# Altium schematic sheet RF MODULE.SchDoc
size A3
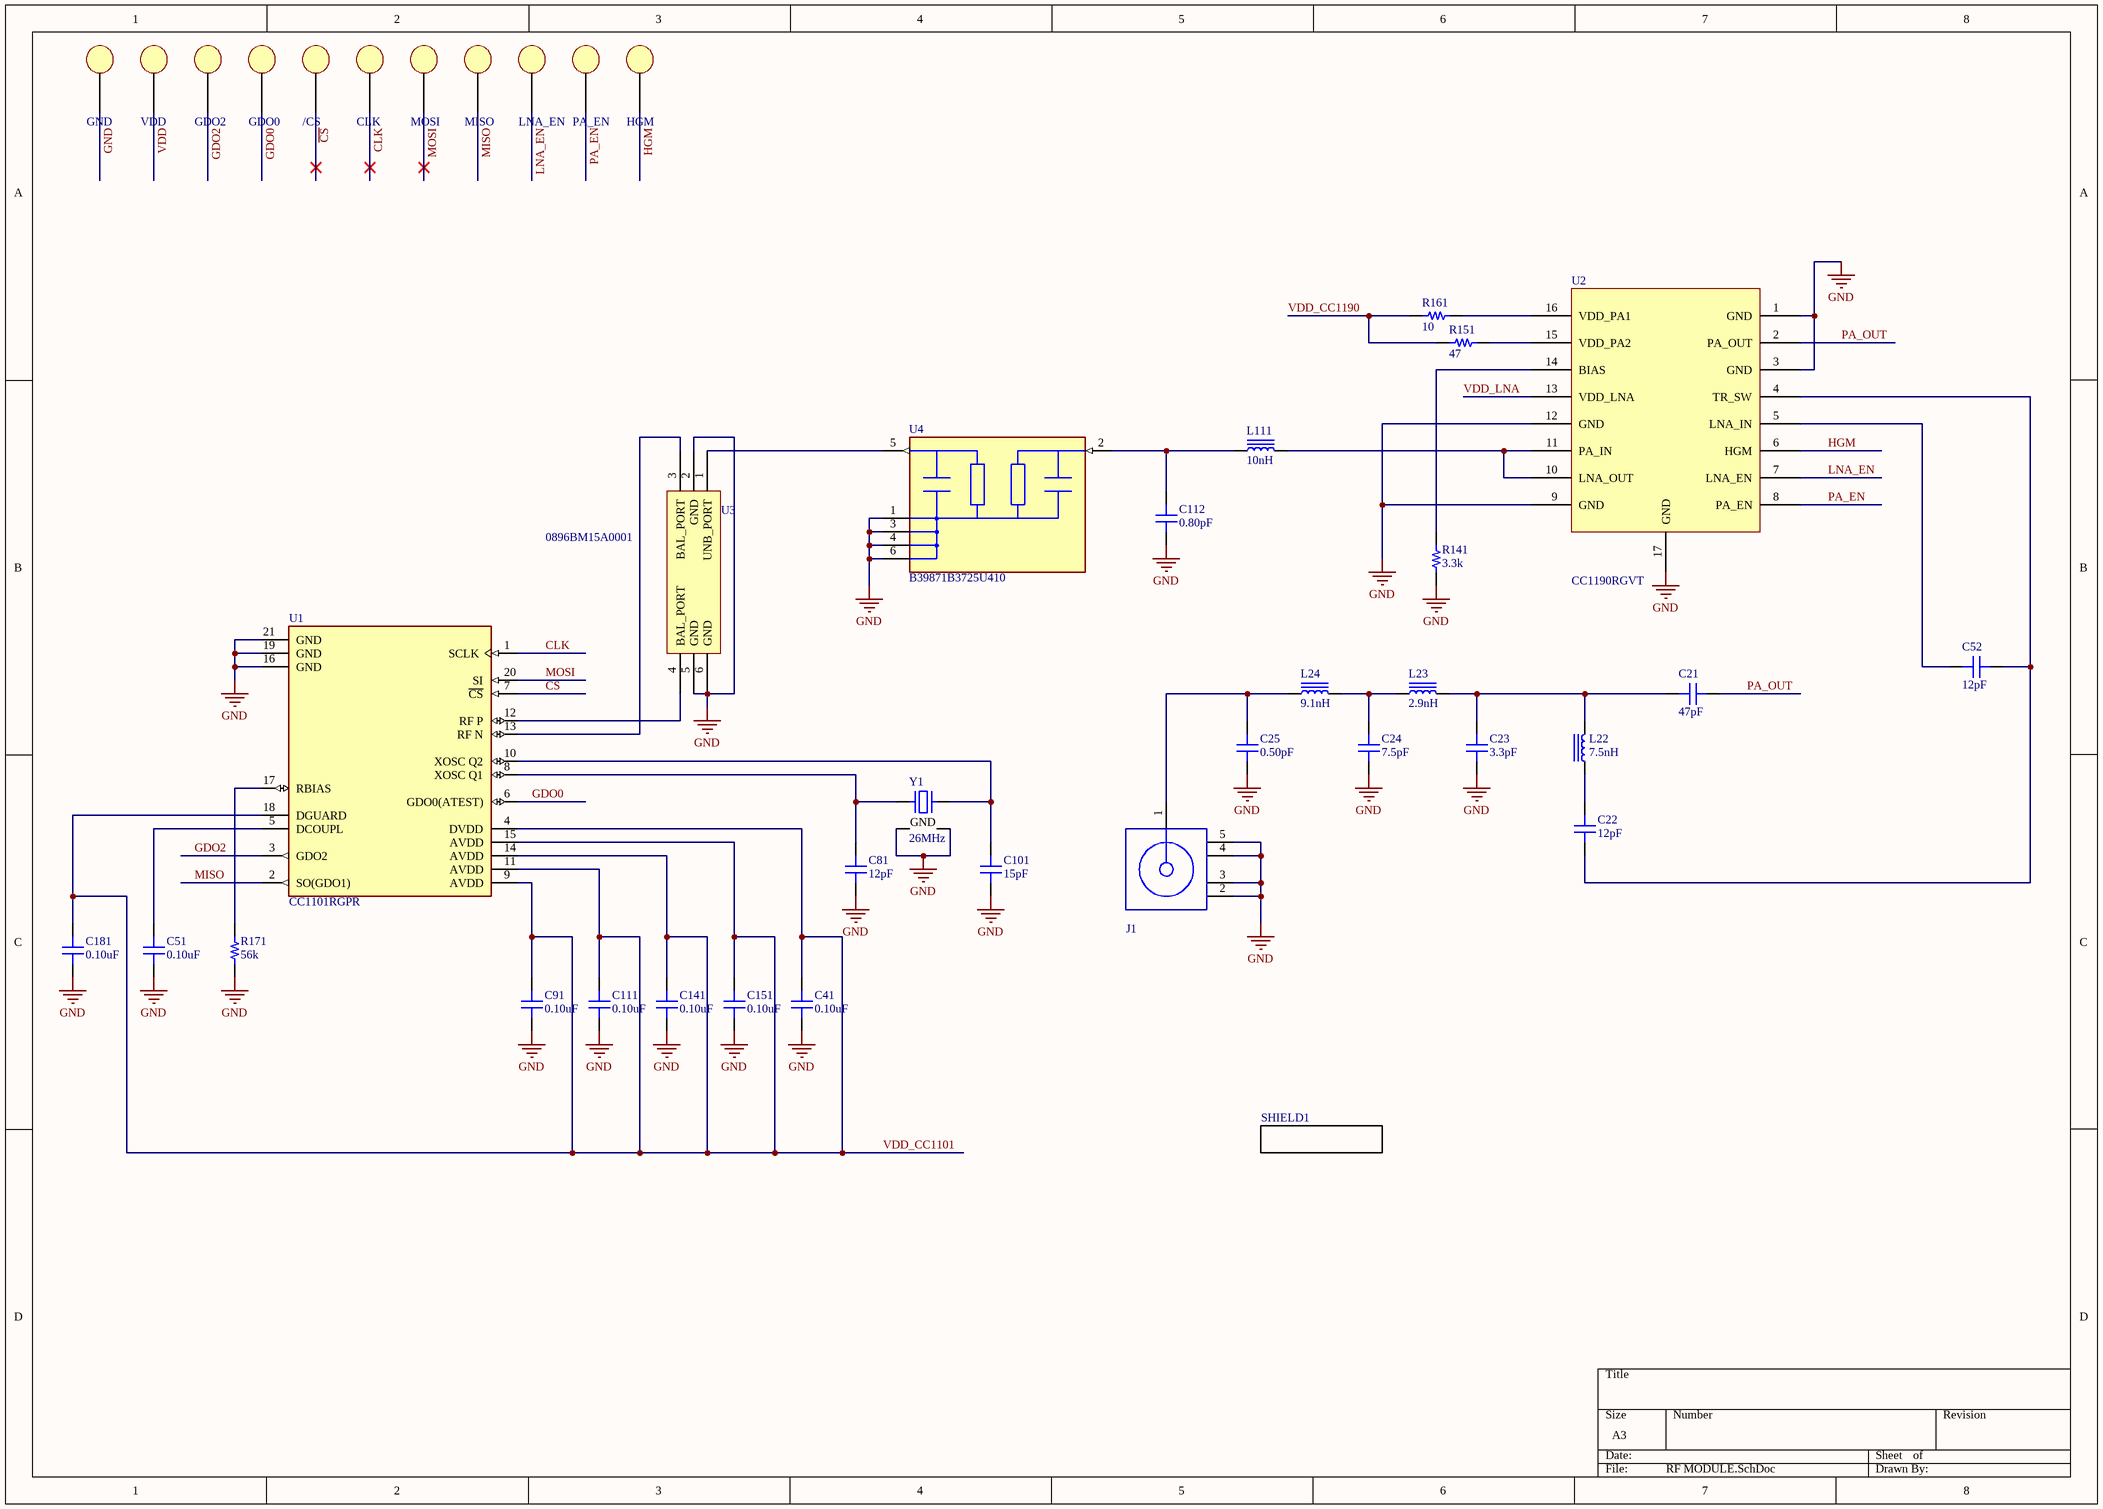
[diagram p0: RF MODULE.SchDoc]

## Parts
/CS  Castellation  [Castellation]  (value not drawn)
C21  47pF  [CAP 0402/1005]
C22  12pF  [CAP 0402/1005]
C23  3.3pF  [CAP 0402/1005]
C24  7.5pF  [CAP 0402/1005]
C25  0.50pF  [CAP 0402/1005]
C41  0.10uF  [CAP 0402/1005]
C51  0.10uF  [CAP 0402/1005]
C52  12pF  [CAP 0402/1005]
C81  12pF  [CAP 0402/1005]
C91  0.10uF  [CAP 0402/1005]
C101  15pF  [CAP 0402/1005]
C111  0.10uF  [CAP 0402/1005]
C112  0.80pF  [CAP 0402/1005]
C141  0.10uF  [CAP 0402/1005]
C151  0.10uF  [CAP 0402/1005]
C181  0.10uF  [CAP 0402/1005]
CLK  Castellation  [Castellation]  (value not drawn)
GDO0  Castellation  [Castellation]  (value not drawn)
GDO2  Castellation  [Castellation]  (value not drawn)
GND  Castellation  [Castellation]  (value not drawn)
HGM  Castellation  [Castellation]  (value not drawn)
J1  73251-1150  [Molex_73251-1150_0]  (value not drawn)
L22  7.5nH  [IND 0402/1005 RF WW]
L23  2.9nH  [IND 0402/1005 RF WW]
L24  9.1nH  [IND 0402/1005 RF WW]
L111  10nH  [IND 0402/1005 RF WW]
LNA_EN  Castellation  [Castellation]  (value not drawn)
MISO  Castellation  [Castellation]  (value not drawn)
MOSI  Castellation  [Castellation]  (value not drawn)
PA_EN  Castellation  [Castellation]  (value not drawn)
R141  3.3k  [RES 0402/1005]
R151  47  [RES 0402/1005]
R161  10  [RES 0402/1005]
R171  56k  [RES 0402/1005]
SHIELD1  SMS-202F  [SMS-202F]  (value not drawn)
U1  CC1101RGPR  [Texas_Instruments_RGP0020C_0]
U2  CC1190RGVT  [QFN65P400X400X100_HS-17N]
U3  0896BM15A0001  [0896BM15A0001]
U4  Part Number: B39871B3725U410  [TDK_B39871B3725U410_0]  (hidden comment: Filter_TDK_B39871B3725U410_eec)
VDD  Castellation  [Castellation]  (value not drawn)
Y1  26MHz  [NDK NX2520SA]

## Nets
GND: C23.1 C24.1 C25.1 C41.1 C51.1 C81.1 C91.1 C101.1 C111.1 C112.1 C141.1 C151.1 C181.1 GND.PIN J1.2(MNT_1) J1.3(MNT_2) J1.4(MNT_3) J1.5(MNT_4) R141.1 R171.1 U1.16(GND) U1.19(GND) U1.21(GND) U2.1(GND) U2.3(GND) U2.9(GND) U2.12(GND) U2.17(GND) U3.2(GND) U3.5(GND) U3.6(GND) U4.1(Ground) U4.3(Ground) U4.4(Ground) U4.6(Ground) Y1.2(GND) Y1.4(GND)
~{CS}: /CS.PIN U1.7(~{CS})
CLK: CLK.PIN U1.1(SCLK)
GDO0: GDO0.PIN U1.6(GDO0(ATEST))
GDO2: GDO2.PIN U1.3(GDO2)
HGM: HGM.PIN U2.6(HGM)
LNA_EN: LNA_EN.PIN U2.7(LNA_EN)
MISO: MISO.PIN U1.2(SO(GDO1))
MOSI: MOSI.PIN U1.20(SI)
PA_EN: PA_EN.PIN U2.8(PA_EN)
PA_OUT: C21.2 U2.2(PA_OUT)
VDD: VDD.PIN
VDD_CC1101: C41.2 C91.2 C111.2 C141.2 C151.2 C181.2 U1.4(DVDD) U1.9(AVDD) U1.11(AVDD) U1.14(AVDD) U1.15(AVDD) U1.18(DGUARD)
VDD_CC1190: R151.1 R161.1
VDD_LNA: U2.13(VDD_LNA)
NetC21_1: C21.1 C23.2 L22.2 L23.2
NetC22_1: C22.1 C52.2 U2.4(TR_SW)
NetC22_2: C22.2 L22.1
NetC24_2: C24.2 L23.1 L24.2
NetC25_2: C25.2 J1.1 L24.1
NetC51_2: C51.2 U1.5(DCOUPL)
NetC52_1: C52.1 U2.5(LNA_IN)
NetC81_2: C81.2 U1.8(XOSC_Q1) Y1.1
NetC101_2: C101.2 U1.10(XOSC_Q2) Y1.3
NetC112_2: C112.2 L111.1 U4.2(Input)
NetL111_2: L111.2 U2.10(LNA_OUT) U2.11(PA_IN)
NetR141_2: R141.2 U2.14(BIAS)
NetR151_2: R151.2 U2.15(VDD_PA2)
NetR161_2: R161.2 U2.16(VDD_PA1)
NetR171_2: R171.2 U1.17(RBIAS)
NetU1_12: U1.12(RF_P) U3.4(BAL_PORT)
NetU1_13: U1.13(RF_N) U3.3(BAL_PORT)
NetU3_1: U3.1(UNB_PORT) U4.5(Output)

## Library data of the parts
/CS CLK GDO0 GDO2 GND HGM LNA_EN MISO MOSI PA_EN VDD = Castellation: CustomComponentID: 5jvg54js08ca3bt85oae
C21 = GRM1555C1H470JA01D: CAP CER 47PF 50V NP0 0402; Manufacturer: Murata Electronics North America; TemperatureRange: -55C ~ 125C; TemperatureCoefficient: C0G, NP0; Tolerance: 5%; Value: 47pF; Part Number: GRM1555C1H470JA01D; PartId: 4827; Supplier 1: Digi-Key; Supplier Part Number 1: 490-5942-2-ND; ComponentLink1Description: Datasheet; ComponentLink1URL: http://www.murata.com/~/media/webrenewal/support/library/catalog/products/capacitor/mlcc/c02e.ashx; ComponentLink2Description: Digi-Key listing; ComponentLink2URL: http://digikey.com/product-detail/en/GRM1555C1H470JA01D/490-5942-2-ND/3693853; Voltage: 50V; Price: 0,0033; Type: -; Device Package: 0402 (1005 Metric)
C22 C81 = GRM1555C1H120JA01D: CAP CER 12PF 50V NP0 0402; Manufacturer: Murata Electronics North America; TemperatureRange: -55C ~ 125C; TemperatureCoefficient: C0G, NP0; Tolerance: 5%; Value: 12pF; Part Number: GRM1555C1H120JA01D; PartId: 4835; Supplier 1: Digi-Key; Supplier Part Number 1: 490-5924-2-ND; ComponentLink1Description: Datasheet; ComponentLink1URL: http://www.murata.com/~/media/webrenewal/support/library/catalog/products/capacitor/mlcc/c02e.ashx; ComponentLink2Description: Digi-Key listing; ComponentLink2URL: http://digikey.com/product-detail/en/GRM1555C1H120JA01D/490-5924-2-ND/3693831; Voltage: 50V; Price: 0,0042; Type: -; Device Package: 0402 (1005 Metric)
C23 = GRM1555C1H3R3CA01D: CAP CER 3.3PF 50V NP0 0402; Manufacturer: Murata Electronics North America; TemperatureRange: -55C ~ 125C; TemperatureCoefficient: C0G, NP0; Tolerance: 0.25pF; Value: 3.3pF; Part Number: GRM1555C1H3R3CA01D; PartId: 4911; Supplier 1: Digi-Key; Supplier Part Number 1: 490-5938-2-ND; ComponentLink1Description: Datasheet; ComponentLink1URL: http://www.murata.com/~/media/webrenewal/support/library/catalog/products/capacitor/mlcc/c02e.ashx; ComponentLink2Description: Digi-Key listing; ComponentLink2URL: http://digikey.com/product-detail/en/GRM1555C1H3R3CA01D/490-5938-2-ND/3693848; Voltage: 50V; Price: 0,0069; Type: -; Device Package: 0402 (1005 Metric)
C24 = GRM1555C1H7R5CA01D: CAP CER 7.5PF 50V NP0 0402; Manufacturer: Murata Electronics North America; TemperatureRange: -55C ~ 125C; TemperatureCoefficient: C0G, NP0; Tolerance: 0.25pF; Value: 7.5pF; Part Number: GRM1555C1H7R5CA01D; PartId: 4924; Supplier 1: Digi-Key; Supplier Part Number 1: 490-7219-2-ND; ComponentLink1Description: Datasheet; ComponentLink1URL: http://www.murata.com/~/media/webrenewal/support/library/catalog/products/capacitor/mlcc/c02e.ashx; ComponentLink2Description: Digi-Key listing; ComponentLink2URL: http://digikey.com/product-detail/en/GRM1555C1H7R5CA01D/490-7219-2-ND/3693883; Voltage: 50V; Price: 0,0069; Type: -; Device Package: 0402 (1005 Metric)
C25 = GRM1555C1HR50BA01D: CAP CER 0.50PF 50V NP0 0402; Manufacturer: Murata Electronics North America; TemperatureRange: -55C ~ 125C; TemperatureCoefficient: C0G, NP0; Tolerance: 0.1pF; Value: 0.50pF; Part Number: GRM1555C1HR50BA01D; PartId: 5016; Supplier 1: Digi-Key; Supplier Part Number 1: 490-6263-2-ND; ComponentLink1Description: Datasheet; ComponentLink1URL: http://www.murata.com/~/media/webrenewal/support/library/catalog/products/capacitor/mlcc/c02e.ashx; ComponentLink2Description: Digi-Key listing; ComponentLink2URL: http://digikey.com/product-detail/en/GRM1555C1HR50BA01D/490-6263-2-ND/3694055; Voltage: 50V; Price: 0,0108; Type: -; Device Package: 0402 (1005 Metric)
C41 C51 C91 C111 C141 C151 C181 = GRM152R61A104KE19D: CAP CER 0.1UF 10V X5R 0402; Manufacturer: Murata Electronics North America; TemperatureRange: -55C ~ 85C; Tolerance: 10%; Value: 0.10uF; Part Number: GRM152R61A104KE19D; PartId: 12630; Supplier 1: Digi-Key; Supplier Part Number 1: 490-10008-2-ND; ComponentLink1Description: Datasheet; ComponentLink1URL: http://www.murata.com/~/media/webrenewal/support/library/catalog/products/capacitor/mlcc/c02e.pdf; ComponentLink2Description: Digi-Key Listing; ComponentLink2URL: https://www.digikey.com/product-detail/en/murata-electronics-north-america/GRM152R61A104KE19D/490-10008-2-ND/4904813; TemperatureCoefficient: X5R; Voltage: 10V; Price: 0,0207; Device Package: 0402 (1005 Metric)
C52 = GRM1555C1H120FA01D: CAP CER 12PF 50V NP0 0402; Manufacturer: Murata Electronics North America; TemperatureRange: -55C ~ 125C; TemperatureCoefficient: C0G, NP0; Tolerance: 1%; Value: 12pF; Part Number: GRM1555C1H120FA01D; PartId: 5082; Supplier 1: Digi-Key; Supplier Part Number 1: 490-6196-2-ND; ComponentLink1Description: Datasheet; ComponentLink1URL: http://www.murata.com/~/media/webrenewal/support/library/catalog/products/capacitor/mlcc/c02e.ashx; ComponentLink2Description: Digi-Key listing; ComponentLink2URL: http://digikey.com/product-detail/en/GRM1555C1H120FA01D/490-6196-2-ND/3693922; Voltage: 50V; Price: 0,0133; Type: -; Device Package: 0402 (1005 Metric)
C101 = GRM1555C1H150JA01D: CAP CER 15PF 50V NP0 0402; Manufacturer: Murata Electronics North America; TemperatureRange: -55C ~ 125C; TemperatureCoefficient: C0G, NP0; Tolerance: 5%; Value: 15pF; Part Number: GRM1555C1H150JA01D; PartId: 4811; Supplier 1: Digi-Key; Supplier Part Number 1: 490-5888-2-ND; ComponentLink1Description: Datasheet; ComponentLink1URL: http://www.murata.com/~/media/webrenewal/support/library/catalog/products/capacitor/mlcc/c02e.ashx; ComponentLink2Description: Digi-Key listing; ComponentLink2URL: http://digikey.com/product-detail/en/GRM1555C1H150JA01D/490-5888-2-ND/2791374; Voltage: 50V; Price: 0,0032; Type: -; Device Package: 0402 (1005 Metric)
C112 = GRM1555C1HR80BA01D: CAP CER 0.80PF 50V NP0 0402; Manufacturer: Murata Electronics North America; TemperatureRange: -55C ~ 125C; TemperatureCoefficient: C0G, NP0; Tolerance: 0.1pF; Value: 0.80pF; Part Number: GRM1555C1HR80BA01D; PartId: 5139; Supplier 1: Digi-Key; Supplier Part Number 1: 490-6269-2-ND; ComponentLink1Description: Datasheet; ComponentLink1URL: http://www.murata.com/~/media/webrenewal/support/library/catalog/products/capacitor/mlcc/c02e.ashx; ComponentLink2Description: Digi-Key listing; ComponentLink2URL: http://digikey.com/product-detail/en/GRM1555C1HR80BA01D/490-6269-2-ND/3694062; Voltage: 50V; Price: 0,0178; Type: -; Device Package: 0402 (1005 Metric)
J1 = 73251-1150: SMA socket
L22 = LQW15AN7N5G00D: FIXED IND 7.5NH 570MA 130 MOHM; Manufacturer: Murata Electronics North America; TemperatureRange: -55C ~ 125C; Tolerance: 2%; Type: Wirewound; Q at Frequency: 25 @ 250MHz; DC Resistance: 130 mOhm Max; Shielding: Unshielded; Value: 7.5nH; Part Number: LQW15AN7N5G00D; PartId: 6416; Supplier 1: Digi-Key; Supplier Part Number 1: 490-6846-2-ND; ComponentLink1Description: Datasheet; ComponentLink1URL: http://search.murata.co.jp/Ceramy/image/img/PDF/ENG/L0075S0080LQW15A_00.pdf; ComponentLink2Description: Digi-Key listing; ComponentLink2URL: http://digikey.com/product-detail/en/LQW15AN7N5G00D/490-6846-2-ND/2594958; Price: 0,0807; Device Package: 0402 (1005 Metric)
L23 = LQW15AN2N9B00D: FIXED IND 2.9NH 750MA 70 MOHM; Manufacturer: Murata Electronics North America; TemperatureRange: -55C ~ 125C; Tolerance: 0.1nH; Type: Wirewound; Q at Frequency: 20 @ 250MHz; DC Resistance: 70 mOhm Max; Shielding: Unshielded; Value: 2.9nH; Part Number: LQW15AN2N9B00D; PartId: 6410; Supplier 1: Digi-Key; Supplier Part Number 1: 490-6801-2-ND; ComponentLink1Description: Datasheet; ComponentLink1URL: http://search.murata.co.jp/Ceramy/image/img/PDF/ENG/L0075S0080LQW15A_00.pdf; ComponentLink2Description: Digi-Key listing; ComponentLink2URL: http://digikey.com/product-detail/en/LQW15AN2N9B00D/490-6801-2-ND/2594891; Price: 0,0807; Device Package: 0402 (1005 Metric)
L24 = LQW15AN9N1G00D: FIXED IND 9.1NH 540MA 140 MOHM; Manufacturer: Murata Electronics North America; TemperatureRange: -55C ~ 125C; Tolerance: 2%; Type: Wirewound; Q at Frequency: 25 @ 250MHz; DC Resistance: 140 mOhm Max; Shielding: Unshielded; Value: 9.1nH; Part Number: LQW15AN9N1G00D; PartId: 6429; Supplier 1: Digi-Key; Supplier Part Number 1: 490-6854-2-ND; ComponentLink1Description: Datasheet; ComponentLink1URL: http://search.murata.co.jp/Ceramy/image/img/PDF/ENG/L0075S0080LQW15A_00.pdf; ComponentLink2Description: Digi-Key listing; ComponentLink2URL: http://digikey.com/product-detail/en/LQW15AN9N1G00D/490-6854-2-ND/2594968; Price: 0,0807; Device Package: 0402 (1005 Metric)
L111 = LQW15AN10NG00D: FIXED IND 10NH 500MA 170 MOHM; Manufacturer: Murata Electronics North America; TemperatureRange: -55C ~ 125C; Tolerance: 2%; Type: Wirewound; Q at Frequency: 25 @ 250MHz; DC Resistance: 170 mOhm Max; Shielding: Unshielded; Value: 10nH; Part Number: LQW15AN10NG00D; PartId: 6397; Supplier 1: Digi-Key; Supplier Part Number 1: 490-6762-2-ND; ComponentLink1Description: Datasheet; ComponentLink1URL: http://search.murata.co.jp/Ceramy/image/img/PDF/ENG/L0075S0080LQW15A_00.pdf; ComponentLink2Description: Digi-Key listing; ComponentLink2URL: http://digikey.com/product-detail/en/LQW15AN10NG00D/490-6762-2-ND/2594843; Price: 0,0807; Device Package: 0402 (1005 Metric)
R141 = ERJ-2RKF3301X: RES SMD 3.3K OHM 1% 1/10W 0402; Manufacturer: Panasonic Electronic Components; TemperatureRange: -55C ~ 155C; TemperatureCoefficient: 100ppm/C; PowerRating: 0.1W, 1/10W; Value: 3.3k; Part Number: ERJ-2RKF3301X; PartId: 159; Supplier 1: Digi-Key; Supplier Part Number 1: P3.30KLTR-ND; ComponentLink1Description: Datasheet; ComponentLink1URL: http://industrial.panasonic.com/www-cgi/jvcr13pz.cgi?E+PZ+3+AOA0002+ERJ2RKF3301X+7+WW; ComponentLink2Description: Digikey listing; ComponentLink2URL: http://digikey.com/product-detail/en/ERJ-2RKF3301X/P3.30KLTR-ND/1746191; Tolerance: 1%; Price: 0,0043; Type: Thick Film; Device Package: 0402 (1005 Metric)
R151 = ERJ-2RKF47R0X: RES SMD 47 OHM 1% 1/10W 0402; Manufacturer: Panasonic Electronic Components; TemperatureRange: -55C ~ 155C; TemperatureCoefficient: 100ppm/C; PowerRating: 0.1W, 1/10W; Value: 47; Part Number: ERJ-2RKF47R0X; PartId: 181; Supplier 1: Digi-Key; Supplier Part Number 1: P47.0LTR-ND; ComponentLink1Description: Datasheet; ComponentLink1URL: http://industrial.panasonic.com/www-cgi/jvcr13pz.cgi?E+PZ+3+AOA0002+ERJ2RKF47R0X+7+WW; ComponentLink2Description: Digikey listing; ComponentLink2URL: http://digikey.com/product-detail/en/ERJ-2RKF47R0X/P47.0LTR-ND/1746238; Tolerance: 1%; Price: 0,0043; Type: Thick Film; Device Package: 0402 (1005 Metric)
R161 = ERJ-2RKF10R0X: RES SMD 10 OHM 1% 1/10W 0402; Manufacturer: Panasonic Electronic Components; TemperatureRange: -55C ~ 155C; TemperatureCoefficient: 100ppm/C; PowerRating: 0.1W, 1/10W; Value: 10; Part Number: ERJ-2RKF10R0X; PartId: 14; Supplier 1: Digi-Key; Supplier Part Number 1: P10.0LTR-ND; ComponentLink1Description: Datasheet; ComponentLink1URL: http://industrial.panasonic.com/www-cgi/jvcr13pz.cgi?E+PZ+3+AOA0002+ERJ2RKF10R0X+7+WW; ComponentLink2Description: Digikey listing; ComponentLink2URL: http://digikey.com/product-detail/en/ERJ-2RKF10R0X/P10.0LTR-ND/192072; Tolerance: 1%; Price: 0,0043; Type: Thick Film; Device Package: 0402 (1005 Metric)
R171 = ERJ-2RKF5602X: RES SMD 56K OHM 1% 1/10W 0402; Manufacturer: Panasonic Electronic Components; TemperatureRange: -55C ~ 155C; TemperatureCoefficient: 100ppm/C; PowerRating: 0.1W, 1/10W; Value: 56k; Part Number: ERJ-2RKF5602X; PartId: 182; Supplier 1: Digi-Key; Supplier Part Number 1: P56.0KLTR-ND; ComponentLink1Description: Datasheet; ComponentLink1URL: http://industrial.panasonic.com/www-cgi/jvcr13pz.cgi?E+PZ+3+AOA0002+ERJ2RKF5602X+7+WW; ComponentLink2Description: Digikey listing; ComponentLink2URL: http://digikey.com/product-detail/en/ERJ-2RKF5602X/P56.0KLTR-ND/1016642; Tolerance: 1%; Price: 0,0043; Type: Thick Film; Device Package: 0402 (1005 Metric)
SHIELD1 = SMS-202F: RF Shield Frame 0.650" (16.51mm) X 0.650" (16.51mm) Surface Mount; MF: Laird; Availability: Unavailable; Package: None; MP: SMS-202F; Price: None; Value: *
U1 = CC1101RGPR: Low-Power Sub-1GHz RF Transceiver 20-QFN -40 to 85
U2 = CC1190RGVT: LNA/PA RF Front End 6.2dB 11.6dB/27.9dB 16-Pin VQFN EP T/R; Lead-Free Status: Lead Free; Antenna Connection: Single Ended; Standby Current: 50.0 nA; Supply Current: 302 mA; Gain: 11.6 dB; Frequency: 850 MHz; Clock Speed: 851 GHz; Supply Voltage (DC): 2.00 V (min); OctopartID: 7662bfab5b7fa9a5; Lifecycle Status: Active; Packaging: Cut Tape (CT); RoHS: Compliant; Manufacturer Part Number: CC1190RGVT; Octopart URL: http://octopart.com/cc1190rgvt-texas+instruments-12781691; Mounting Style: Surface Mount; Number of Pins: 16; REACH SVHC Compliance: No SVHC
U3 = 0896BM15A0001: 868/915 MHz Impedance Matched/Balun/LPF Integrated Component; Part Number: 0896BM15A0001
U4 = Filter_TDK_B39871B3725U410_eec: FILTER SAW 869.0MHZ SMD; Manufacturer: TDK; Frequency - Center: 869MHz; Insertion Loss: 2.5dB; Bandwidth: 2MHz; helpURL: https://upverter.com/upn/revision/07501646d9ed6846/; ComponentLink2Description: Datasheet; Temperature: -45°C to +125°C; Package: SMD_FILTER_3MM0; Supplier 2: Mouser; Supplier 1: Digi-Key; ComponentLink1URL: https://upverter.com/upn/revision/07501646d9ed6846/; Supplier Part Number 2: 871-B39871B3725U410; Supplier Part Number 1: 495-7095-1-ND; ComponentLink1Description: Upverter; ComponentLink2URL: https://en.rf360jv.com/inf/40/ds/ae/B3725.pdf; RoHS: TRUE; Mouser Part Number: 871-B39871B3725U410; Temperature Range High: +125°C; Digikey Description: FILTER SAW 869.0MHZ SMD; Digikey Part Number: 495-7095-1-ND; Lead Free: yes; Temperature Range Low: -45°C
Y1 = NX2520SA-26.000000MHZ: CRYSTAL 26.0000MHZ 10PF SMD; Manufacturer: NDK; Frequency Stability: 10ppm; ESR: 70 Ohm; Operating Mode: Fundamental; Part Number: NX2520SA-26.000000MHZ; PartId: 8497; Supplier 1: Digi-Key; Supplier Part Number 1: 644-1063-2-ND; ComponentLink1Description: Datasheet; ComponentLink1URL: http://media.digikey.com/pdf/Data%20Sheets/NDK%20PDFs/NX2520SA.pdf; ComponentLink2Description: Digi-Key Listing; ComponentLink2URL: http://www.digikey.com/product-detail/en/NX2520SA-26.000000MHZ/644-1063-2-ND/1128845; Price: 0,7336; Type: MHz Crystal; Device Package: 4-SMD, No Lead (DFN, LCC); Frequency: 26MHz; Frequency Tolerance: 10ppm; Load Capacitance: 10pF